# EAGLE design BehaviorShield-PowerEnable-DB9 (EAGLE 9.2.2)
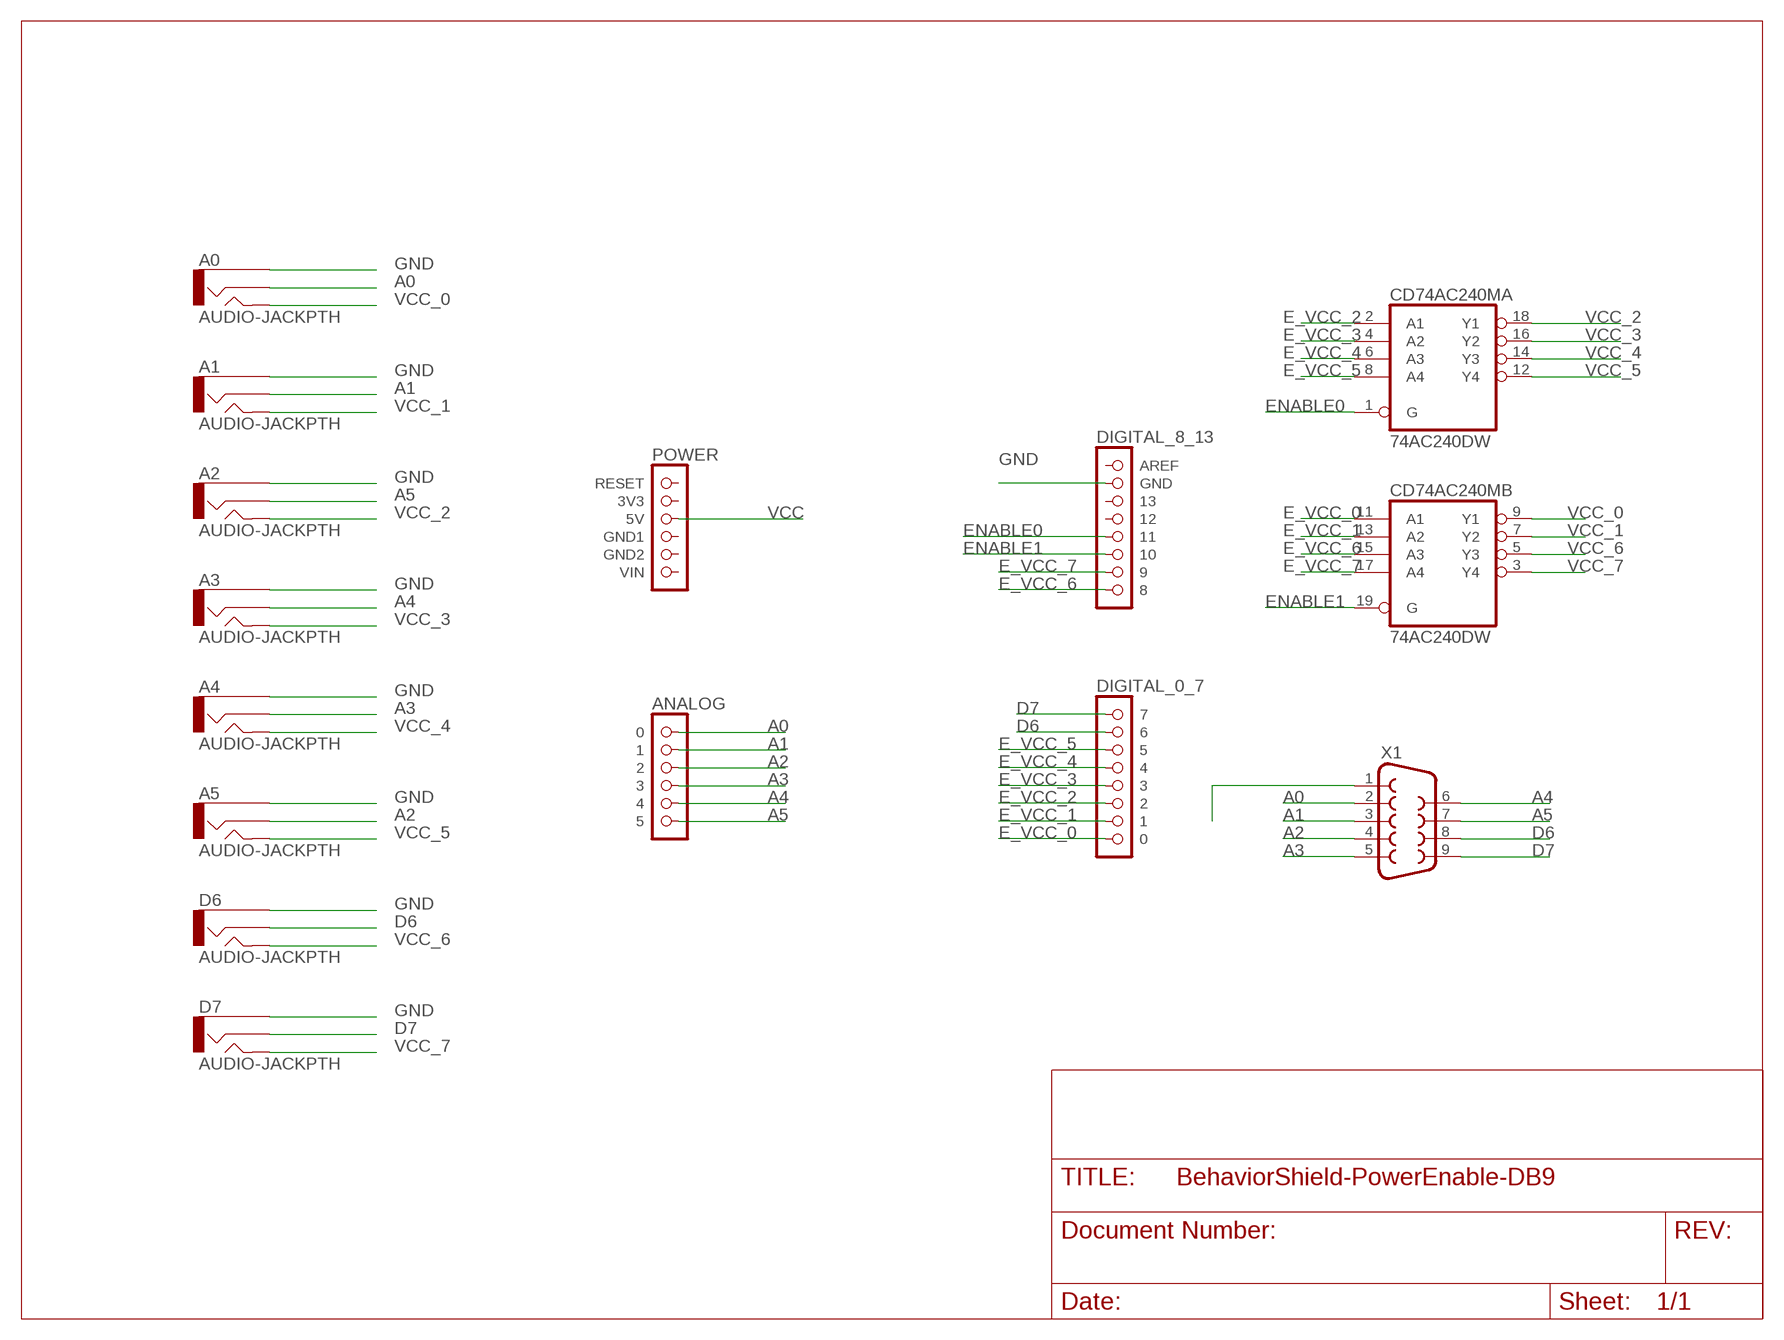
[diagram p0: schematic, sheet 1]

## Parts
A0  AUDIO-JACKPTH  [AUDIO-JACK]
A1  AUDIO-JACKPTH  [AUDIO-JACK]
A2  AUDIO-JACKPTH  [AUDIO-JACK]
A3  AUDIO-JACKPTH  [AUDIO-JACK]
A4  AUDIO-JACKPTH  [AUDIO-JACK]
A5  AUDIO-JACKPTH  [AUDIO-JACK]
CD74AC240M  74AC240DW  [SO20W]
D6  AUDIO-JACKPTH  [AUDIO-JACK]
D7  AUDIO-JACKPTH  [AUDIO-JACK]
U$1  POWER  [1X06]
U$2  ANALOG  [1X06]
U$3  DIGITAL_0_7  [1X08]
U$4  DIGITAL_8_13  [1X08]
X1  F09HP  [F09HP]

## Nets
A0: A0.2 U$2.1 X1.2
A1: A1.2 U$2.2 X1.3
A2: A5.2 U$2.3 X1.4
A3: A4.2 U$2.4 X1.5
A4: A3.2 U$2.5 X1.6
A5: A2.2 U$2.6 X1.7
D6: D6.2 U$3.2 X1.8
D7: D7.2 U$3.1 X1.9
E_VCC_0: CD74AC240M.11(B:A1) U$3.8
E_VCC_1: CD74AC240M.13(B:A2) U$3.7
E_VCC_2: CD74AC240M.2(A:A1) U$3.6
E_VCC_3: CD74AC240M.4(A:A2) U$3.5
E_VCC_4: CD74AC240M.6(A:A3) U$3.4
E_VCC_5: CD74AC240M.8(A:A4) U$3.3
E_VCC_6: CD74AC240M.15(B:A3) U$4.8
E_VCC_7: CD74AC240M.17(B:A4) U$4.7
ENABLE0: CD74AC240M.1(A:G) U$4.5
ENABLE1: CD74AC240M.19(B:G) U$4.6
GND: A0.1 A1.1 A2.1 A3.1 A4.1 A5.1 D6.1 D7.1 U$4.2(GND) X1.1
VCC: U$1.3(5V)
VCC_0: A0.5 CD74AC240M.9(B:Y1)
VCC_1: A1.5 CD74AC240M.7(B:Y2)
VCC_2: A2.5 CD74AC240M.18(A:Y1)
VCC_3: A3.5 CD74AC240M.16(A:Y2)
VCC_4: A4.5 CD74AC240M.14(A:Y3)
VCC_5: A5.5 CD74AC240M.12(A:Y4)
VCC_6: CD74AC240M.5(B:Y3) D6.5
VCC_7: CD74AC240M.3(B:Y4) D7.5
Unconnected: U$1.1(RESET) U$1.2(3V3) U$1.4(GND1) U$1.5(GND2) U$1.6(VIN) U$4.1(AREF) U$4.3 U$4.4

## Power pins joined to a net without a drawn wire
GND: CD74AC240M.10(P:GND)
VCC: CD74AC240M.20(P:VCC)

## Library data of the parts
A0 A1-A5 D6 D7 = SparkFun:AUDIO-JACK: 3.5mm Audio Jack Simple 3.5mm common PCB mount audio jack. SKU: PRT-08032
CD74AC240M = 74xx-eu:74*240: Octal BUFFER and LINE DRIVER, 3-state
U$1 = arduino:POWER
U$2 = arduino:ANALOG
U$3 = arduino:DIGITAL_0_7
U$4 = arduino:DIGITAL_8_13
X1 = con-subd:F09: SUB-D; OC_FARNELL: unknown; OC_NEWARK: unknown

## Board
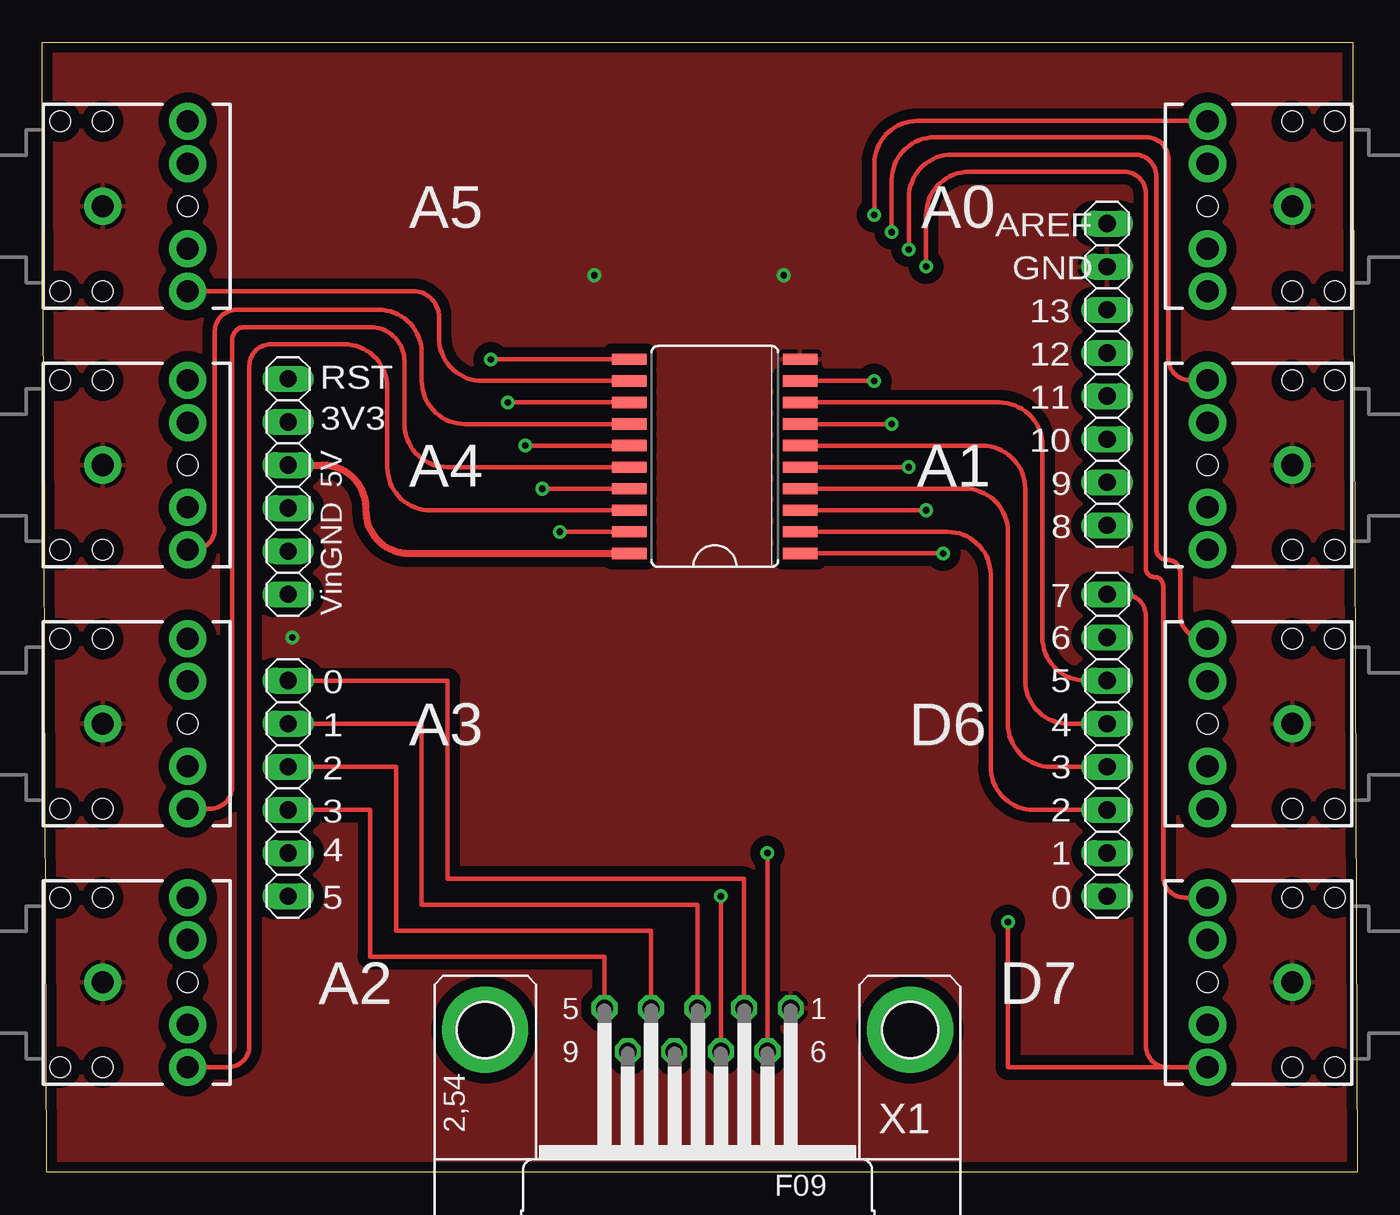
[diagram p1: board, top side]
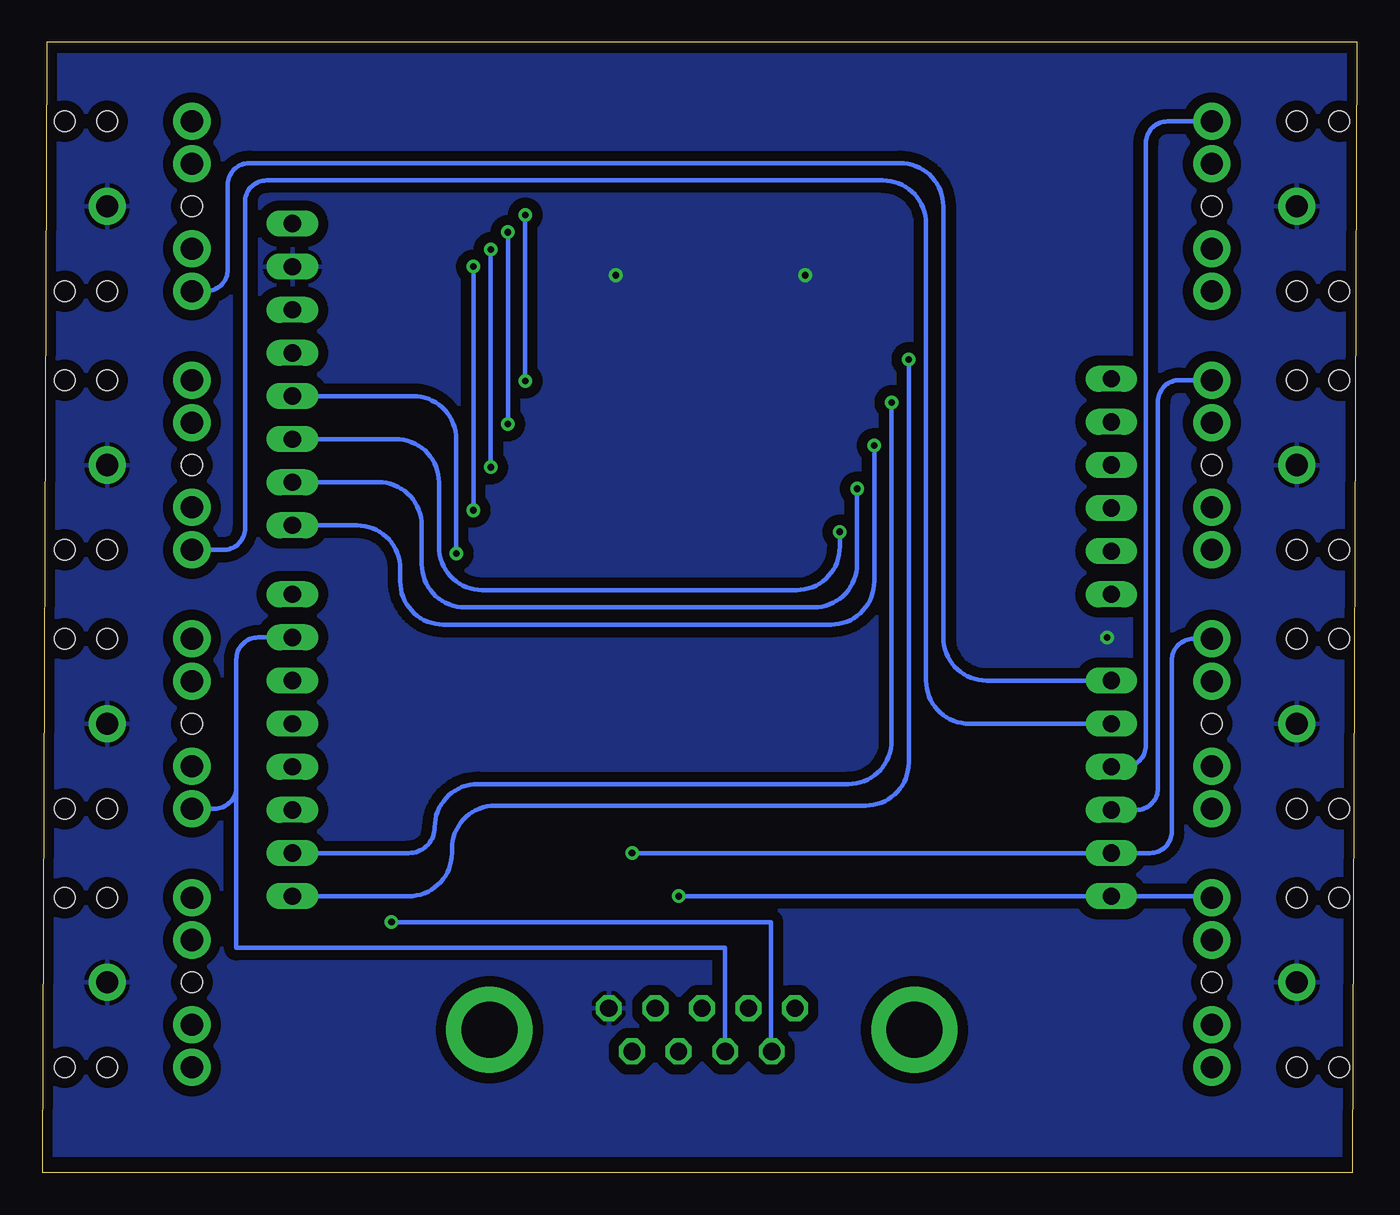
[diagram p2: board, bottom side, seen from below]

Size 77.47 x 66.55 mm. Coordinates in mm from the lower left corner, seen from the top.
Outline: 0,66.55 77.22,66.55 77.47,0 0.25,0 0,66.55
Copper layers (1*16): Top 0.035mm / dielectric 1.5mm / Bottom 0.035mm
Design rules "adafruit": minimum track width 8mil, minimum drill 15.5mil, track to track 8mil, track to pad 8mil, pad to pad 8mil, via to via 8mil, smd to smd 8mil, copper to edge 10mil, drill to drill 8mil, minimum pad ring 10mil, minimum via ring 8mil, stop-mask expansion 2mil, vias tented up to drill 20mil, thermal gap 10mil

### Footprints (pad centres in the part's own frame; a part is rotated, then mirrored left to right if it is on the bottom)
AUDIO-JACK = drill 1.3 pad 2.184: 1 0,0; 2 5,5; 3 5,2.5; 4 5,-2.5; 5 5,-5 | hole 1.2: 0,5; -2.5,5; -2.5,-5; 0,-5; 5,0
SO20W = smd 0.66 x 2.032: 1 -5.715,-5.029; 2 -4.445,-5.029; 3 -3.175,-5.029; 4 -1.905,-5.029; 5 -0.635,-5.029; 6 0.635,-5.029; 7 1.905,-5.029; 8 3.175,-5.029; 9 4.445,-5.029; 10 5.715,-5.029; 11 5.715,5.029; 12 4.445,5.029; 13 3.175,5.029; 14 1.905,5.029; 15 0.635,5.029; 16 -0.635,5.029; 17 -1.905,5.029; 18 -3.175,5.029; 19 -4.445,5.029; 20 -5.715,5.029
1X06 = drill 1.016 long: 1 -6.35,0; 2 -3.81,0; 3 -1.27,0; 4 1.27,0; 5 3.81,0; 6 6.35,0
1X08 = drill 1.016 long: 1 -8.89,0; 2 -6.35,0; 3 -3.81,0; 4 -1.27,0; 5 1.27,0; 6 3.81,0; 7 6.35,0; 8 8.89,0
F09HP = drill 1.016 octagon: 1 -5.486,-1.27; 2 -2.743,-1.27; 3 0,-1.27; 4 2.743,-1.27; 5 5.486,-1.27; 6 -4.115,1.27; 7 -1.372,1.27; 8 1.372,1.27; 9 4.115,1.27 | drill 3.302 pad 5.08: G1 -12.522,0; G2 12.522,0

### Placement (x,y rotation side)
A0  73.66,56.9 180 top
A1  73.66,41.66 180 top
A2  3.56,11.18 0 top
A3  3.56,26.42 0 top
A4  3.56,41.66 0 top
A5  3.56,56.9 0 top
CD74AC240M  39.62,42.16 90 top
D6  73.66,26.42 180 top
D7  73.66,11.18 180 top
U$1  14.48,40.39 270 top
U$2  14.48,22.61 270 top
U$3  62.74,25.15 270 top
U$4  62.74,46.99 270 top
X1  38.61,8.38 180 top

### Tracks (layer width: path | path; a pad name or v marks a point on that pad's centre or on a via)
A0
  Top 0.254: X1.2 41.35,17.27 23.88,17.27 23.88,28.96 U$2.1
  Bottom 0.254: U$2.1 21.84,28.96 arc90 24.38,31.5 24.38,56.9 arc-90 26.92,59.44 65.28,59.44 arc-90 66.55,58.17 66.55,53.17 arc90 67.82,51.9 A0.2
A1
  Top 0.254: X1.3 38.61,15.75 22.35,15.75 22.35,26.42 U$2.2
  Bottom 0.254: U$2.2 22.86,26.42 arc90 25.4,28.96 25.4,55.88 arc-90 27.94,58.42 64.26,58.42 arc-90 65.53,57.15 65.53,37.93 arc90 66.8,36.66 A1.2
A2
  Top 0.254: U$2.3 20.83,23.88 20.83,14.22 35.87,14.22 X1.4
  Bottom 0.254: U$2.3 13.72,23.88 arc-90 12.45,25.15 12.45,60.63 arc90 11.18,61.9 A5.2
A3
  Top 0.254: U$2.4 19.3,21.34 19.3,12.7 33.12,12.7 X1.5
  Bottom 0.254: U$2.4 13.01,21.34 arc-90 11.73,22.61 11.73,45.39 arc90 10.46,46.66 A4.2
A4  (via drill 0.39)
  Top 0.254: v42.72,18.8 X1.6
  Bottom 0.254: A3.2 9.65,31.42 arc-90 10.92,30.15 10.92,20.07 arc90 12.19,18.8 U$2.5 v42.72,18.8
A5  (via drill 0.39)
  Top 0.254: v39.98,16.26 X1.7
  Bottom 0.254: A2.2 8.56,16.26 U$2.6 v39.98,16.26
D6
  Bottom 0.254: U$3.2 64.77,31.5 arc-90 66.04,30.23 66.04,22.69 | 66.04,22.69 arc90 67.31,21.42 D6.2 | X1.8 37.24,13.21 66.04,13.21 66.04,22.69
D7  (via drill 0.39)
  Top 0.254: U$3.1 63.75,34.04 arc-90 65.02,32.77 65.02,7.45 arc90 66.29,6.18 D7.2 56.9,6.18 v56.9,14.73
  Bottom 0.254: X1.9 34.54,7.11 34.54,14.73 v56.9,14.73
E_VCC_0  (via drill 0.39)
  Top 0.254: v26.42,47.88 CD74AC240M.11
  Bottom 0.254: U$3.8 55.88,16.26 arc-90 53.34,18.8 53.34,19.05 arc90 50.8,21.59 28.96,21.59 arc-90 26.42,24.13 v26.42,47.88
E_VCC_1  (via drill 0.39)
  Top 0.254: CD74AC240M.13 v27.43,45.34
  Bottom 0.254: U$3.7 55.88,18.8 arc-90 54.36,20.32 arc90 51.82,22.86 29.97,22.86 arc-90 27.43,25.4 v27.43,45.34
E_VCC_2
  Top 0.254: CD74AC240M.2 53.34,37.72 arc-90 55.88,35.18 55.88,23.88 arc90 58.42,21.34 U$3.6
E_VCC_3
  Top 0.254: CD74AC240M.4 54.36,40.26 arc-90 56.9,37.72 56.9,26.42 arc90 59.44,23.88 U$3.5
E_VCC_4
  Top 0.254: CD74AC240M.6 55.37,42.8 arc-90 57.91,40.26 57.91,28.96 arc90 60.45,26.42 U$3.4
E_VCC_5
  Top 0.254: CD74AC240M.8 56.39,45.34 arc-90 58.93,42.8 58.93,31.5 arc90 61.47,28.96 U$3.3
E_VCC_6  (via drill 0.39)
  Top 0.254: CD74AC240M.15 v28.45,42.8
  Bottom 0.254: U$4.8 58.93,38.1 arc90 56.39,35.56 56.39,34.8 arc-90 53.85,32.26 30.99,32.26 arc-90 28.45,34.8 v28.45,42.8
E_VCC_7  (via drill 0.39)
  Top 0.254: CD74AC240M.17 v29.46,40.26
  Bottom 0.254: U$4.7 57.66,40.64 arc90 55.12,38.1 55.12,35.81 arc-90 52.58,33.27 32,33.27 arc-90 29.46,35.81 v29.46,40.26
ENABLE0  (via drill 0.39)
  Top 0.254: CD74AC240M.1 v53.09,36.45
  Bottom 0.254: v53.09,36.45 53.09,43.18 arc-90 55.63,45.72 U$4.5
ENABLE1  (via drill 0.39)
  Top 0.254: v30.48,37.72 CD74AC240M.19
  Bottom 0.254: v30.48,37.72 30.48,36.83 arc90 33.02,34.29 51.56,34.29 arc90 54.1,36.83 54.1,40.64 arc-90 56.64,43.18 U$4.6
GND  (via drill 0.39)
  other vias: 32.51,52.83 43.69,52.83 14.73,31.5
  pour Bottom (isolate 0.61): 0.25,65.79 77.72,65.79 77.72,1.02 0.25,1.02
  pour Top (isolate 0.61): 0.25,66.55 75.95,66.55 arc-90 77.47,65.02 77.47,0 1.52,0 arc-90 0.25,1.27
VCC
  Top 0.254: 19.05,39.12 19.05,38.99
  Top 0.406: U$1.3 16.51,41.66 arc-90 19.05,39.12 | 19.05,38.99 arc90 21.59,36.45 CD74AC240M.20
VCC_0  (via drill 0.39)
  Top 0.254: CD74AC240M.9 v49.02,46.61 | v49.02,56.39 49.02,59.38 arc-90 51.56,61.92 68.63,61.92 arc-90 A0.5
  Bottom 0.254: v49.02,46.61 v49.02,56.39
VCC_1  (via drill 0.39)
  Top 0.254: CD74AC240M.7 v50.04,44.07 | v50.04,55.37 50.04,58.42 arc-90 52.58,60.96 65.08,60.96 arc-90 66.34,59.69 66.34,47.93 arc90 67.61,46.66 A1.5
  Bottom 0.254: v50.04,44.07 v50.04,55.37
VCC_2
  Top 0.254: CD74AC240M.18 22.86,38.99 arc-90 20.32,41.53 20.32,46.23 arc90 17.78,48.77 13.46,48.77 arc90 12.19,47.5 12.19,16.08 12.19,7.45 arc-90 10.92,6.18 A2.5
VCC_3
  Top 0.254: 11.18,28.78 11.18,28.96 | 11.18,28.96 11.18,49.02 arc-90 11.94,49.78 19.3,49.78 arc-90 21.34,47.75 21.34,44.07 arc90 23.88,41.53 CD74AC240M.16 | 11.18,28.96 11.18,22.69 arc-90 9.91,21.42 A3.5
VCC_4
  Top 0.254: CD74AC240M.14 24.89,44.07 arc-90 22.35,46.61 22.35,48.26 arc90 19.81,50.8 11.43,50.8 arc90 10.16,49.53 10.16,41.48 10.16,37.93 arc-90 8.89,36.66 A4.5
VCC_5
  Top 0.254: CD74AC240M.12 25.91,46.61 arc-90 23.37,49.15 23.37,50.37 arc90 21.84,51.9 A5.5
VCC_6  (via drill 0.39)
  Top 0.254: v51.05,41.53 CD74AC240M.5 | v51.05,54.36 51.05,57.4 arc-90 53.59,59.94 64.36,59.94 arc-90 65.63,58.67 65.63,36.73 arc90 66.29,36.07 arc-90 67.06,35.31 67.06,32.77 arc90 68.33,31.5 68.66,31.5 D6.5
  Bottom 0.254: v51.05,54.36 v51.05,41.53
VCC_7  (via drill 0.39)
  Top 0.254: CD74AC240M.3 v52.07,38.99 | v52.07,53.34 52.07,56.39 arc-90 54.61,58.93 63.75,58.93 arc-90 65.02,57.66 65.02,35.56 arc90 65.53,35.05 arc-90 66.04,34.54 66.04,17.45 arc90 67.31,16.18 D7.5
  Bottom 0.254: v52.07,38.99 v52.07,53.34

### Text on the board
tNames: AREF | GND | 13 | 12 | RST | 11 | 3V3 | 5V | 10 | 9 | GND | 8 | Vin | 7 | 6 | 0 | 5 | 1 | 4 | 2 | 3 | 3 | 2 | 4 | 1 | 5 | 0
tDocu: Behavior Shield + | V 3.0 Kemere Lab 2019 | Shield=GND / Ring=Signal / Tip=5V ! Switched !